# Altium schematic sheet LPCB228 - POWERUP.SchDoc
size A3; Address1: Factory 10; Address2: 9-13 Dingley Avenue, Dandeong, VICTORIA 3175, AUSTRALIA; DocumentNumber: 2; Revision: 1; SheetNumber: 2; SheetTotal: 2; Lockie__PCB_SUB_ASSEMBLY: Power / Ignitor; Lockie__PCB_ASSEMBLY: Main; Lockie__LDL: LPCB228; Lockie__PCB_DESCRIPTION: DC/DC Converter
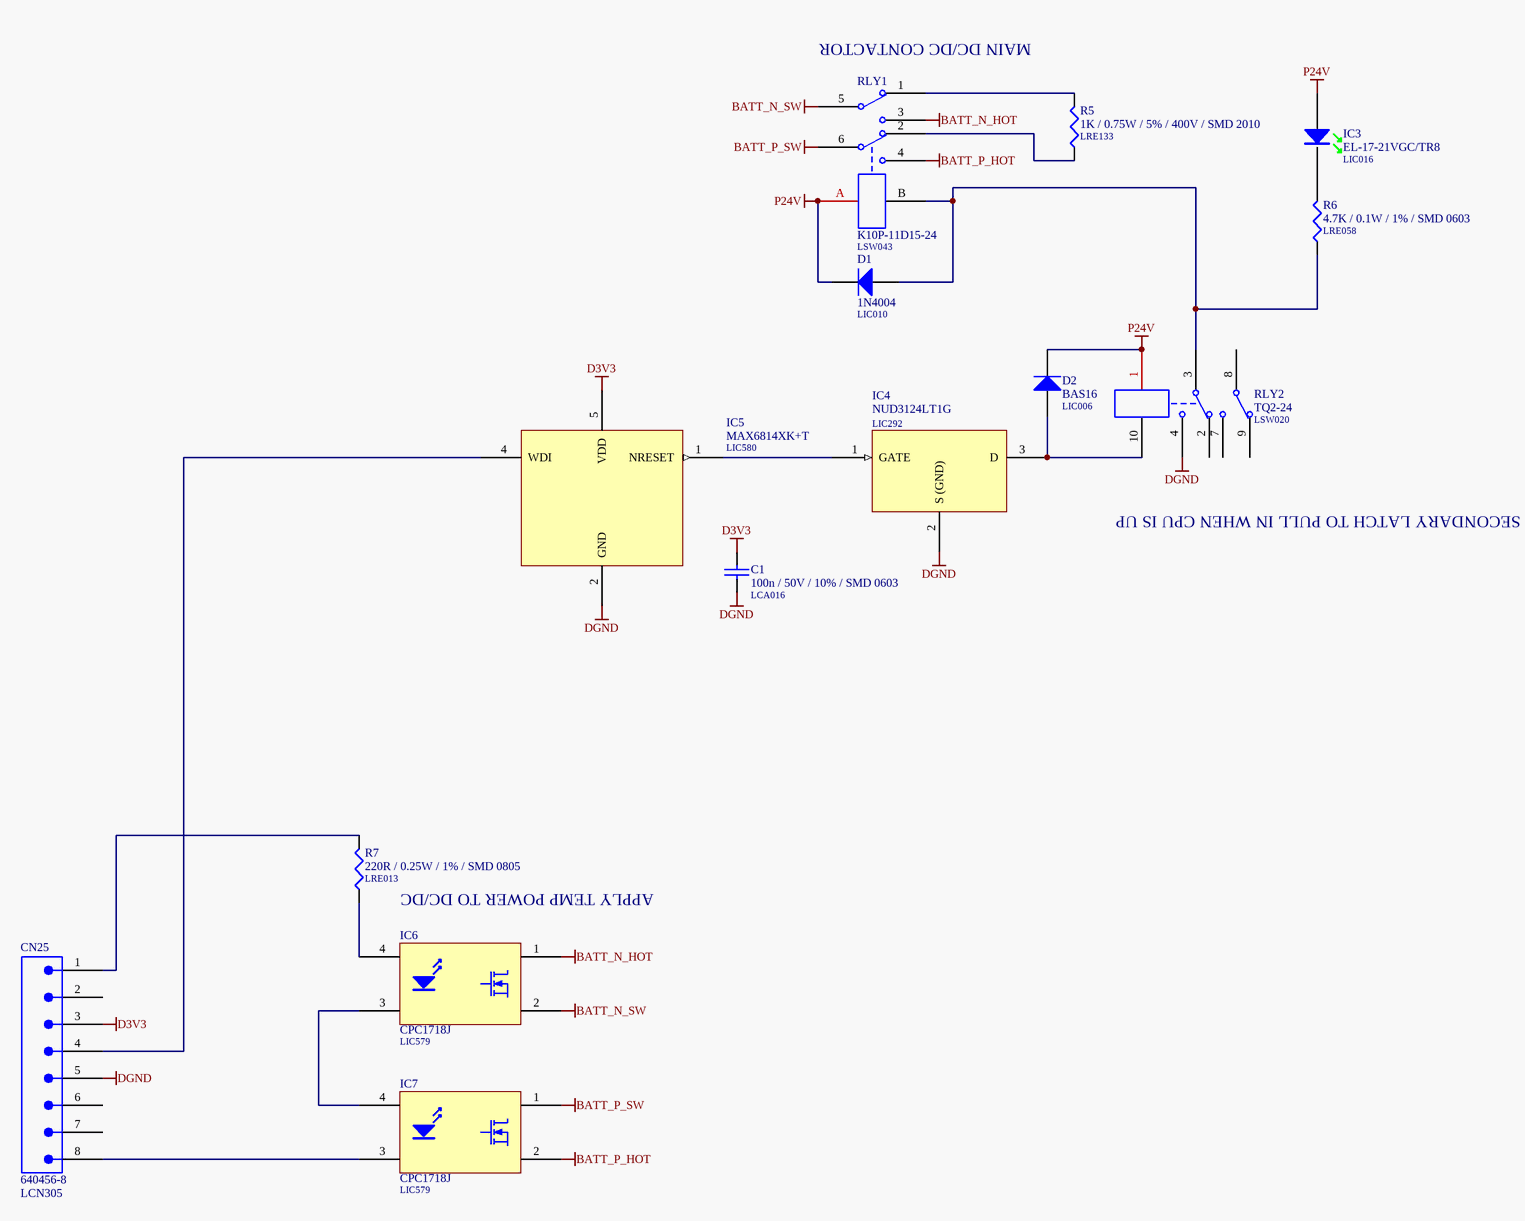
[diagram p0: LPCB228 - POWERUP.SchDoc]

## Parts
C1  100n / 50V / 10% / SMD 0603  LDL_NUMBER: LCA016  [LFP011__CC1608-0603-IPC7351_B]
CN25  640456-8  LDL_NUMBER: LCN305  [640456-8]
D1  1N4004  LDL_NUMBER: LIC010  [DO-41]
D2  BAS16  LDL_NUMBER: LIC006  [LFP021__SOT23]
IC3  EL-17-21VGC/TR8  LDL_NUMBER: LIC016  [CR2012-0805-LED]
IC4  NUD3124LT1G  LDL_NUMBER: LIC292  [LFP021__SOT23]
IC5  MAX6814XK+T  LDL_NUMBER: LIC580  [LFP047__SOT353]
IC6  CPC1718J  LDL_NUMBER: LIC579  [ISOPLUS-264]
IC7  CPC1718J  LDL_NUMBER: LIC579  [ISOPLUS-264]
R5  1K / 0.75W / 5% / 400V / SMD 2010  LDL_NUMBER: LRE133  [LFP060__CR5025-2010]
R6  4.7K / 0.1W / 1% / SMD 0603  LDL_NUMBER: LRE058  [LFP020__CR1608-0603-IPC7351_B]
R7  220R / 0.25W / 1% / SMD 0805  LDL_NUMBER: LRE013  [LFP029__CR2012-0805]
RLY1  K10P-11D15-24  LDL_NUMBER: LSW043  [K10P-11D15-24]
RLY2  TQ2-24  LDL_NUMBER: LSW020  [TQ2]

## Nets
BATT_N_HOT: IC6.1 RLY1.3
BATT_N_SW: IC6.2 RLY1.5
BATT_P_HOT: IC7.2 RLY1.4
BATT_P_SW: IC7.1 RLY1.6
D3V3: C1.1 CN25.3 IC5.5(VDD)
DGND: C1.2 CN25.5 IC4.2(S_(GND)) IC5.2(GND) RLY2.4
P24V: D1.K D2.3(K) IC3.A RLY1.A RLY2.1
NetCN25_1: CN25.1 R7.2
NetCN25_4: CN25.4 IC5.4(WDI)
NetCN25_8: CN25.8 IC7.3
NetD1_A: D1.A R6.1 RLY1.B RLY2.3
NetD2_1: D2.1(A) IC4.3(D) RLY2.10
NetIC3_K: IC3.K R6.2
NetIC4_1: IC4.1(GATE) IC5.1(NRESET)
NetIC6_3: IC6.3 IC7.4
NetIC6_4: IC6.4 R7.1
NetR5_1: R5.1 RLY1.2
NetR5_2: R5.2 RLY1.1

Not connected (* = marked no-connect by the designer): CN25 2 6 7; RLY2 2 7 8 9

## Notes on the sheet
- (near RLY1) MAIN DC/DC CONTACTOR
- SECONDARY LATCH TO PULL IN WHEN CPU IS UP
- APPLY TEMP POWER TO DC/DC
- PCB COMPONENT DESCRIPTION
- LDL NUMBER
- Assembly Details
- Size
- Drawing File Name
- Revision
- http://rloop.org
- Scale
- A3
- Sheet Details
- N.T.S
- Sheet:
- Of:

## Library data of the parts
C1 = 100n / 50V / 10% / SMD 0603: Capacitor, Ceramic Chip, 100nF (0.1uF), 50V, 5%, SMD 0603 [LCA016]; FMEDA__OPERATING__VOLTAGE_MIN: 0; FMEDA__OPERATING__VOLTAGE_MAX: 3.3; FMEDA__OPERATING__TEMP_MIN: -20; FMEDA__OPERATING__TEMP_TYP: 27; FMEDA__OPERATING__TEMP_MAX: 50; FMEDA__CHANNEL: COM; Value: 100n; FMEDA__FUNCTION_IN_SYSTEM: *; FMEDA__OPERATING__VOLTAGE_TYP: 3.3
CN25 = 640456-8: Connector, Male Header, 8 Way; FMEDA__CHANNEL: COM; FMEDA__OPERATING__CURRENT_MAX: 0; FMEDA__OPERATING__TEMP_MAX: 50; FMEDA__OPERATING__TEMP_MIN: -20; FMEDA__OPERATING__TEMP_TYP: 27; FMEDA__OPERATING__VOLTAGE_MAX: 16; FMEDA__OPERATING__VOLTAGE_TYP: 12; FMEDA__FUNCTION_IN_SYSTEM: *; FMEDA__OPERATING__CURRENT_MIN: 0; FMEDA__OPERATING__CURRENT_TYP: 0; FMEDA__OPERATING__VOLTAGE_MIN: 0
D1 = 1N4004: Diode, General Purpose Rectifier, 1A, PTH [LIC010]; FMEDA__OPERATING__TEMP_MAX: 50; FMEDA__OPERATING__TEMP_MIN: -20; FMEDA__OPERATING__TEMP_TYP: 27; FMEDA__OPERATING__VOLTAGE_MAX: 0; FMEDA__CHANNEL: COM; FMEDA__FUNCTION_IN_SYSTEM: *; FMEDA__OPERATING__VOLTAGE_MIN: 0; FMEDA__OPERATING__VOLTAGE_TYP: 0; FMEDA__OPERATING__CURRENT_MAX: 0; FMEDA__OPERATING__CURRENT_MIN: 0; FMEDA__OPERATING__CURRENT_TYP: 0
D2 = BAS16: Diode, Small Signal, 0.2A, 85V, SMD SOT-23 [LIC006]; FMEDA__OPERATING__CURRENT_MIN: 0; FMEDA__OPERATING__TEMP_MIN: -20; FMEDA__OPERATING__TEMP_TYP: 27; FMEDA__OPERATING__TEMP_MAX: 50; FMEDA__CHANNEL: COM; FMEDA__OPERATING__CURRENT_MAX: 0; FMEDA__OPERATING__VOLTAGE_MIN: 0; FMEDA__OPERATING__VOLTAGE_MAX: 0; FMEDA__FUNCTION_IN_SYSTEM: *; FMEDA__OPERATING__CURRENT_TYP: 0; FMEDA__OPERATING__VOLTAGE_TYP: 0
IC3 = EL-17-21VGC/TR8: LED, SMD, 0805 Green [LIC016]; FMEDA__OPERATING__TEMP_MAX: 50; FMEDA__OPERATING__TEMP_MIN: -20; FMEDA__OPERATING__TEMP_TYP: 27; FMEDA__CHANNEL: COM; FMEDA__FUNCTION_IN_SYSTEM: *
IC4 = NUD3124LT1G: IC, Relay Driver, 28V Industrial, SMD SOT23 [LIC292]; FMEDA__OPERATING__TEMP_MIN: -20; FMEDA__OPERATING__TEMP_TYP: 27; FMEDA__OPERATING__TEMP_MAX: 50; FMEDA__OPERATING__VOLTAGE_MIN: 0; FMEDA__OPERATING__VOLTAGE_TYP: 13; FMEDA__OPERATING__VOLTAGE_MAX: 18; FMEDA__OPERATING__POWER_TYP: 0.1; FMEDA__OPERATING__POWER_MAX: 0.15; FMEDA__CHANNEL: COM; FMEDA__FUNCTION_IN_SYSTEM: *; FMEDA__OPERATING__POWER_MIN: 0
IC5 = MAX6814XK+T: IC, Watchdog, SMD [LIC580]; FMEDA__OPERATING__TEMP_MIN: -20; FMEDA__OPERATING__TEMP_TYP: 27; FMEDA__OPERATING__TEMP_MAX: 50; FMEDA__OPERATING__VOLTAGE_MIN: 0; FMEDA__OPERATING__VOLTAGE_TYP: 3.3; FMEDA__CHANNEL: COM; FMEDA__FUNCTION_IN_SYSTEM: *; FMEDA__OPERATING__VOLTAGE_MAX: 3.3
IC6 IC7 = CPC1718J: IC, Solid State Relay, PTH [LIC579]; FMEDA__OPERATING__TEMP_MAX: 50; FMEDA__OPERATING__TEMP_MIN: -20; FMEDA__OPERATING__TEMP_TYP: 27; FMEDA__CHANNEL: COM; FMEDA__FUNCTION_IN_SYSTEM: *
R5 = 1K / 0.75W / 5% / 400V / SMD 2010: Resistor, Thick Film, 1K, 0.75W, 5%, 400V, SMD 2010 [LRE133]; FMEDA__OPERATING__POWER_MAX: 0; FMEDA__OPERATING__TEMP_MAX: 50; FMEDA__OPERATING__TEMP_MIN: -20; FMEDA__OPERATING__TEMP_TYP: 27; FMEDA__CHANNEL: COM; Value: 1K; FMEDA__OPERATING__POWER_MIN: 0; FMEDA__OPERATING__VOLTAGE_MAX: 0; FMEDA__OPERATING__VOLTAGE_MIN: 0; FMEDA__OPERATING__VOLTAGE_TYP: 0; FMEDA__FUNCTION_IN_SYSTEM: *
R6 = 4.7K / 0.1W / 1% / SMD 0603: Resistor, Ceramic Chip, 4K7, 0.1W, 1%, SMD 0603 [LRE058]; FMEDA__OPERATING__POWER_MAX: 0; FMEDA__OPERATING__TEMP_MAX: 50; FMEDA__OPERATING__TEMP_MIN: -20; FMEDA__OPERATING__TEMP_TYP: 27; FMEDA__CHANNEL: COM; VALUE: 4.7K; FMEDA__OPERATING__POWER_MIN: 0; FMEDA__OPERATING__VOLTAGE_MAX: 0; FMEDA__OPERATING__VOLTAGE_MIN: 0; FMEDA__OPERATING__VOLTAGE_TYP: 0; FMEDA__FUNCTION_IN_SYSTEM: *
R7 = 220R / 0.25W / 1% / SMD 0805: Resistor, Ceramic Chip, 220R, 0.25W, 1%, SMD 0805 [LRE013]; Value: 220; FMEDA__OPERATING__POWER_MAX: 0; FMEDA__OPERATING__TEMP_MAX: 50; FMEDA__OPERATING__TEMP_MIN: -20; FMEDA__OPERATING__TEMP_TYP: 27; FMEDA__CHANNEL: COM; FMEDA__OPERATING__POWER_MIN: 0; FMEDA__OPERATING__VOLTAGE_MAX: 0; FMEDA__OPERATING__VOLTAGE_MIN: 0; FMEDA__OPERATING__VOLTAGE_TYP: 0; FMEDA__FUNCTION_IN_SYSTEM: *
RLY1 = K10P-11D15-24: Relay, DPDT, 24V, Socket Mount; FMEDA__OPERATING__TEMP_MAX: 50; FMEDA__OPERATING__TEMP_MIN: -20; FMEDA__OPERATING__TEMP_TYP: 27; FMEDA__CHANNEL: COM; Revision: July-2002: Re-released for DXP Platform.; FMEDA__FUNCTION_IN_SYSTEM: *
RLY2 = TQ2-24: Relay, DPDT, Non Latching, 24VDC Coil, 1A Rating, PTH; FMEDA__CHANNEL: COM; FMEDA__OPERATING__TEMP_MAX: 50; FMEDA__OPERATING__TEMP_MIN: -20; FMEDA__OPERATING__TEMP_TYP: 27; Revision: July-2002: Re-released for DXP Platform.